# Altium schematic sheet Peripherals.SchDoc
size A; SheetNumber: 2; SheetTotal: 2
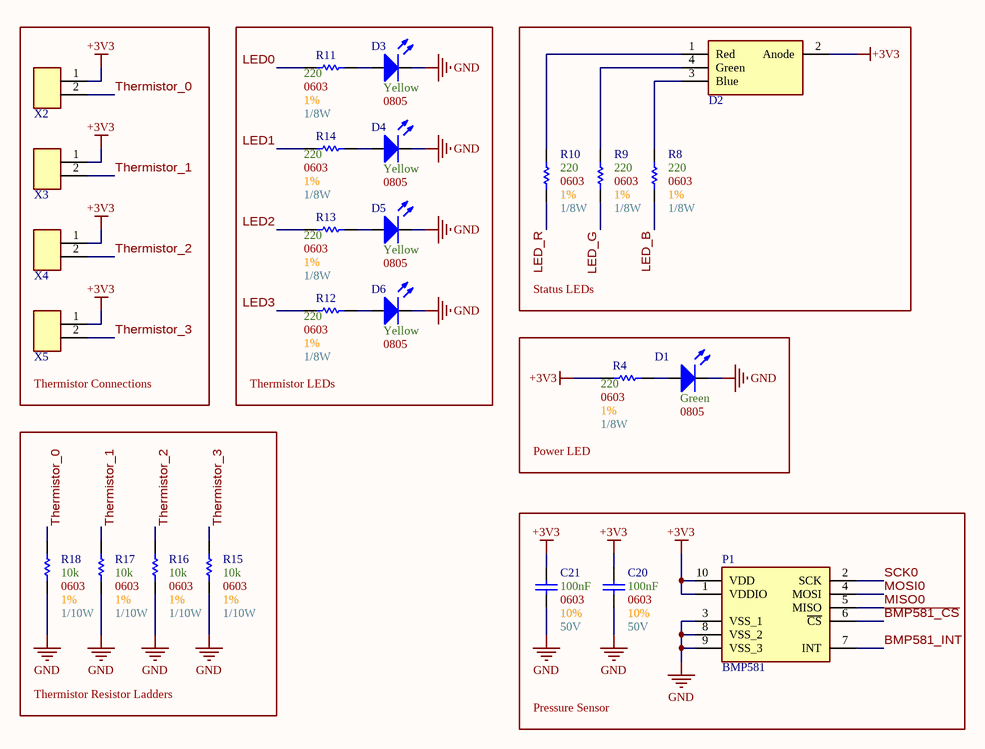
[diagram p0: Peripherals.SchDoc]

## Parts
C20  Max Voltage: 50V  Size Package: 0603  Tolerance: 10%  Capacitance: 100nF  [[Cap] SMD 0603]  (hidden comment: [Cap] 0603 0.1uF 10% 50V)
C21  Max Voltage: 50V  Size Package: 0603  Tolerance: 10%  Capacitance: 100nF  [[Cap] SMD 0603]  (hidden comment: [Cap] 0603 0.1uF 10% 50V)
D1  Color: Green  Size Package: 0805  [[LED] SMD 0805]  (hidden comment: [LED] SMD 0805 Green)
D2  [LED] SMD RGB 1.55x1.55mm  [[LED] SMD RGB 1.55x1.55mm]  (value not drawn)
D3  Color: Yellow  Size Package: 0805  [[LED] SMD 0805]  (hidden comment: [LED] SMD 0805 Yellow)
D4  Color: Yellow  Size Package: 0805  [[LED] SMD 0805]  (hidden comment: [LED] SMD 0805 Yellow)
D5  Color: Yellow  Size Package: 0805  [[LED] SMD 0805]  (hidden comment: [LED] SMD 0805 Yellow)
D6  Color: Yellow  Size Package: 0805  [[LED] SMD 0805]  (hidden comment: [LED] SMD 0805 Yellow)
P1  BMP581  [[Sensor] Barometric Pressure Sensor]
R4  Wattage: 1/8W  Tolerance: 1%  Resistance: 220  Size Package: 0603  [[Res] SMD 0603]  (hidden comment: [220] SMD 0603 1% 1/10W)
R8  Wattage: 1/8W  Tolerance: 1%  Resistance: 220  Size Package: 0603  [[Res] SMD 0603]  (hidden comment: [220] SMD 0603 1% 1/10W)
R9  Wattage: 1/8W  Tolerance: 1%  Resistance: 220  Size Package: 0603  [[Res] SMD 0603]  (hidden comment: [220] SMD 0603 1% 1/10W)
R10  Wattage: 1/8W  Tolerance: 1%  Resistance: 220  Size Package: 0603  [[Res] SMD 0603]  (hidden comment: [220] SMD 0603 1% 1/10W)
R11  Wattage: 1/8W  Tolerance: 1%  Resistance: 220  Size Package: 0603  [[Res] SMD 0603]  (hidden comment: [220] SMD 0603 1% 1/10W)
R12  Wattage: 1/8W  Tolerance: 1%  Resistance: 220  Size Package: 0603  [[Res] SMD 0603]  (hidden comment: [220] SMD 0603 1% 1/10W)
R13  Wattage: 1/8W  Tolerance: 1%  Resistance: 220  Size Package: 0603  [[Res] SMD 0603]  (hidden comment: [220] SMD 0603 1% 1/10W)
R14  Wattage: 1/8W  Tolerance: 1%  Resistance: 220  Size Package: 0603  [[Res] SMD 0603]  (hidden comment: [220] SMD 0603 1% 1/10W)
R15  Wattage: 1/10W  Tolerance: 1%  Resistance: 10k  Size Package: 0603  [[Res] SMD 0603]  (hidden comment: [10k] SMD 0603 1% 1/8W)
R16  Wattage: 1/10W  Tolerance: 1%  Resistance: 10k  Size Package: 0603  [[Res] SMD 0603]  (hidden comment: [10k] SMD 0603 1% 1/8W)
R17  Wattage: 1/10W  Tolerance: 1%  Resistance: 10k  Size Package: 0603  [[Res] SMD 0603]  (hidden comment: [10k] SMD 0603 1% 1/8W)
R18  Wattage: 1/10W  Tolerance: 1%  Resistance: 10k  Size Package: 0603  [[Res] SMD 0603]  (hidden comment: [10k] SMD 0603 1% 1/8W)
X2  [Sherlock] 2pin  [[Sherlock] 2pin]  (value not drawn)
X3  [Sherlock] 2pin  [[Sherlock] 2pin]  (value not drawn)
X4  [Sherlock] 2pin  [[Sherlock] 2pin]  (value not drawn)
X5  [Sherlock] 2pin  [[Sherlock] 2pin]  (value not drawn)

## Blocks framed on the sheet
Thermistor Connections: X2-X5
Thermistor LEDs: D3-D6 R11-R14
Status LEDs: D2 R8-R10
Power LED: D1 R4
Thermistor Resistor Ladders: R15-R18
Pressure Sensor: C20 C21 P1

## Nets
+3V3: C20.2 C21.2 D2.2(Anode) P1.1(VDDIO) P1.10(VDD) R4.1 X2.1 X3.1 X4.1 X5.1
GND: C20.1 C21.1 D1.2(Cathode) D3.2(Cathode) D4.2(Cathode) D5.2(Cathode) D6.2(Cathode) P1.3(VSS_1) P1.8(VSS_2) P1.9(VSS_3) R15.1 R16.1 R17.1 R18.1
~{BMP581_CS}: P1.6(~{CS})
BMP581_INT: P1.7(INT)
LED0: R11.1
LED1: R14.1
LED2: R13.1
LED3: R12.1
LED_B: R8.1
LED_G: R9.1
LED_R: R10.1
MISO0: P1.5(MISO)
MOSI0: P1.4(MOSI)
SCK0: P1.2(SCK)
Thermistor_0: R18.2 X2.2
Thermistor_1: R17.2 X3.2
Thermistor_2: R16.2 X4.2
Thermistor_3: R15.2 X5.2
NetD1_1: D1.1(Anode) R4.2
NetD2_1: D2.1(Red) R10.2
NetD2_3: D2.3(Blue) R8.2
NetD2_4: D2.4(Green) R9.2
NetD3_1: D3.1(Anode) R11.2
NetD4_1: D4.1(Anode) R14.2
NetD5_1: D5.1(Anode) R13.2
NetD6_1: D6.1(Anode) R12.2

## Library data of the parts
C20 C21 = [Cap] 0603 0.1uF 10% 50V: CL10B104KB8NNNC; Supplier 1: DigiKey; Supplier Part Number 1: 1276-1000-6-ND
D1 = [LED] SMD 0805 Green: LG R971-KN-1-0-20-R18; Supplier 1: DigiKey; Supplier Part Number 1: 475-LGR971-KN-1CT-ND
D2 = [LED] SMD RGB 1.55x1.55mm: LTST-E143EGBW-P1; Supplier 1: DigiKey; Supplier Part Number 1: 160-LTST-E143EGBW-P1CT-ND
D3-D6 = [LED] SMD 0805 Yellow: LY R976-PS-36-0-20-R18; Supplier 1: DigiKey; Supplier Part Number 1: 475-LYR976-PS-36-0-20-R18CT-ND
P1 = [Sensor] Barometric Pressure Sensor: Supplier 1: DigiKey; Supplier Part Number 1: 828-BMP581DKR-ND
R4 R8-R14 = [220] SMD 0603 1% 1/10W: CRGCQ0805F220R; Supplier 1: DigiKey; Supplier Part Number 1: A129741CT-ND
R15-R18 = [10k] SMD 0603 1% 1/8W: RMCF0603FT10K0; Supplier 1: DigiKey; Supplier Part Number 1: RMCF0603FT10K0DKR-ND
X2-X5 = [Sherlock] 2pin: 0353620250; Supplier 1: DigiKey; Supplier Part Number 1: WM18920-ND